# EAGLE design EEZ Mosfet pre-regulator r3B3b (SS) (EAGLE 6.1)
Assembly variants: Farnell, TME
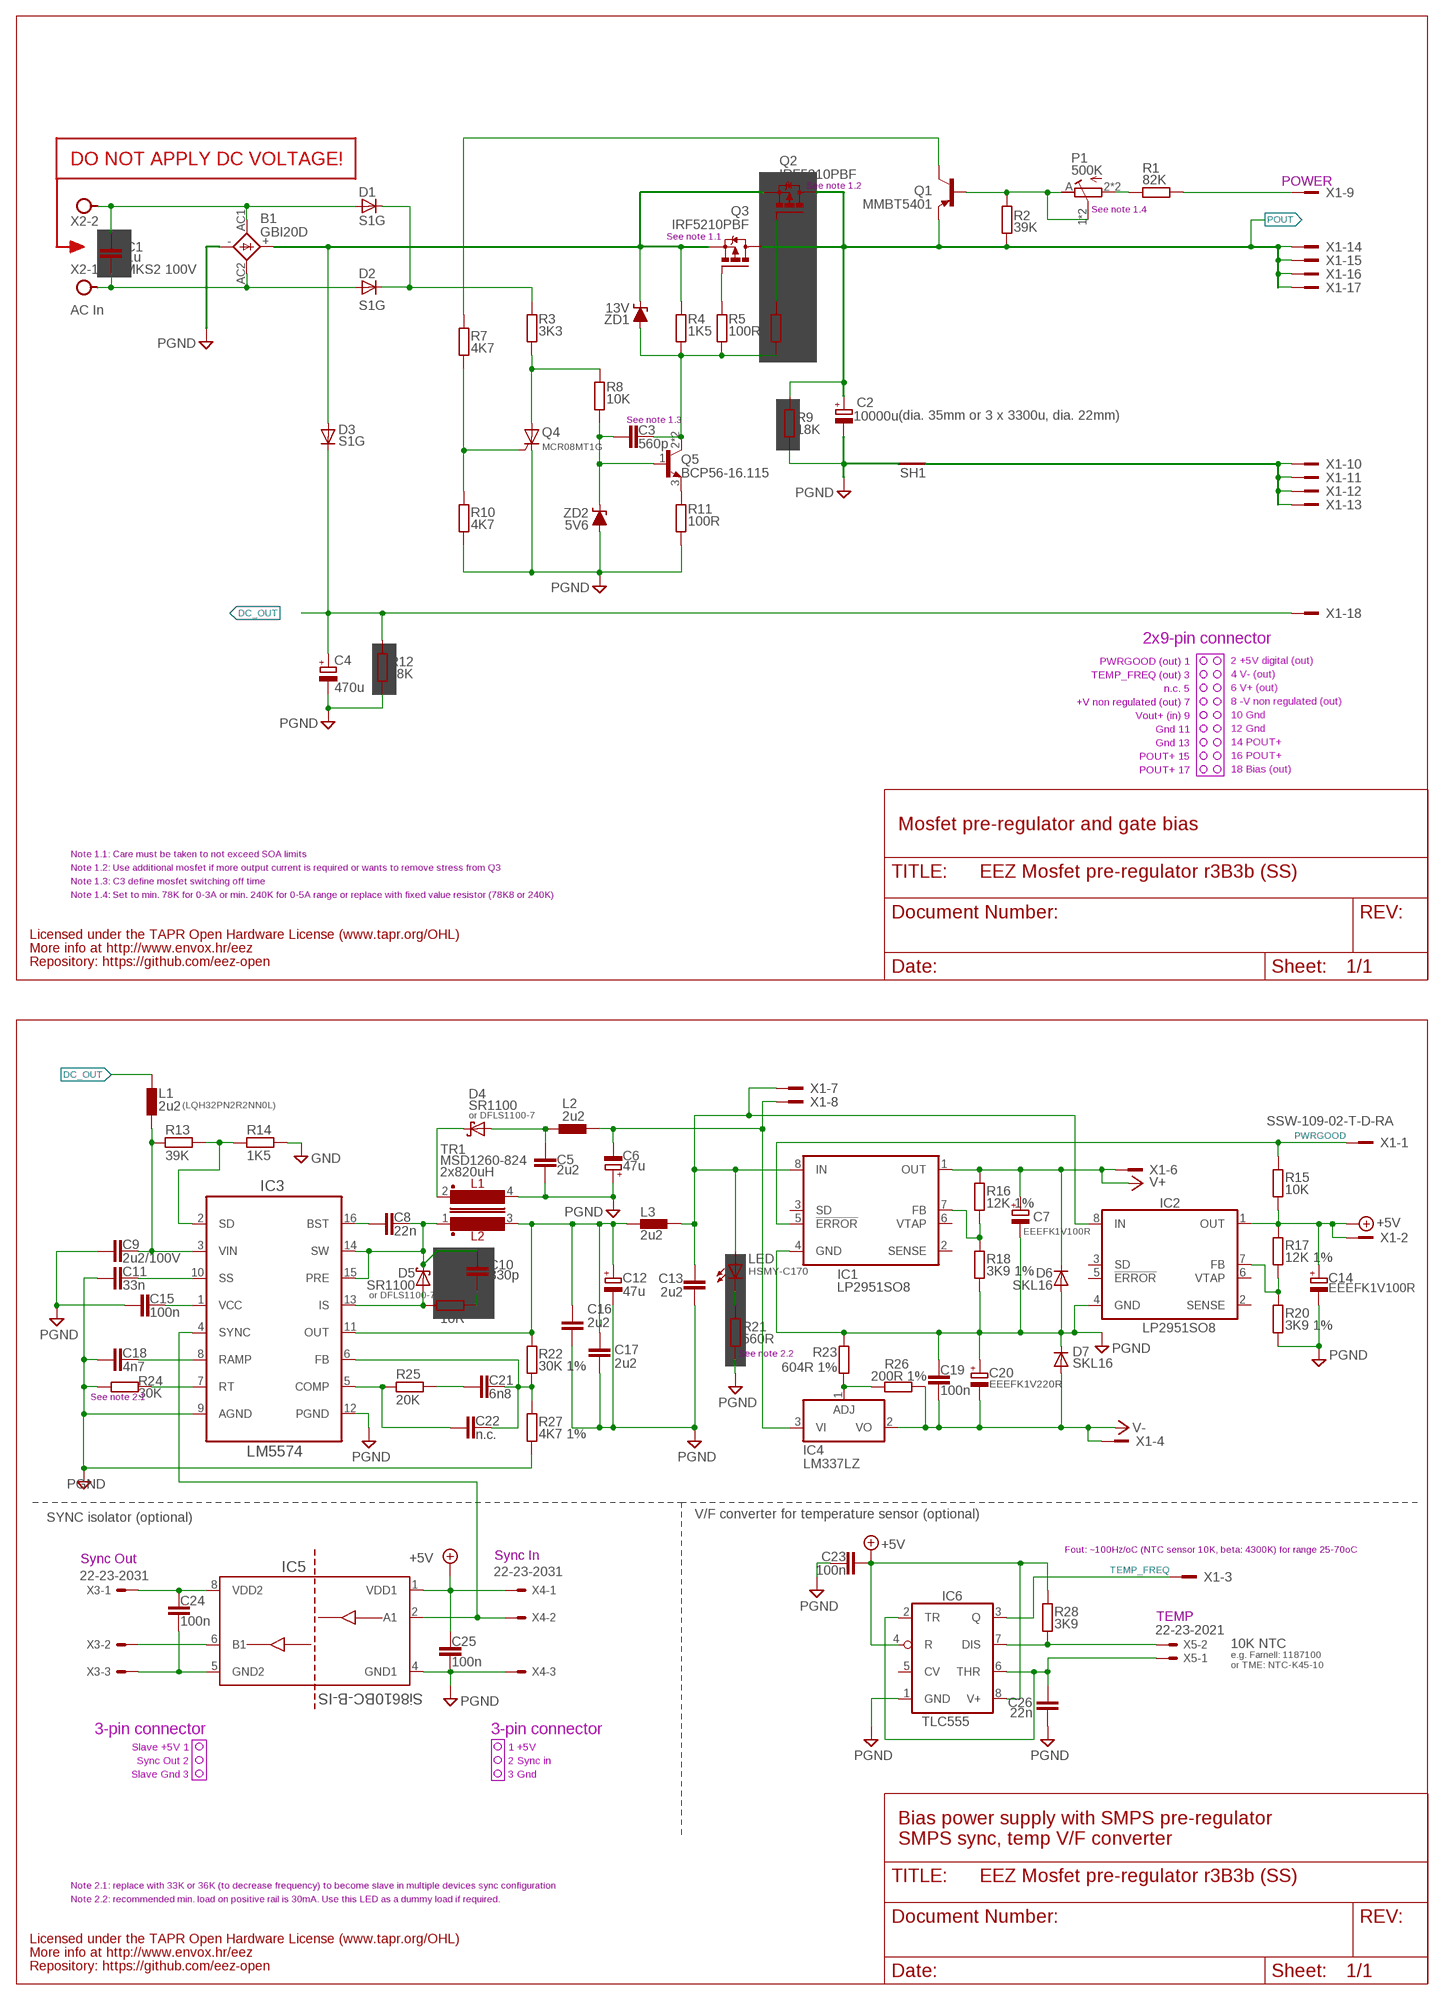
[diagram p0: schematic, sheet 1]

## Parts
B1  GBI20D  BRIDGEDIOTEC  [GBI20]
C1  1u  C-EU050-075X075  [C050-075X075]
C2  10000u  ECAP35+3X22.5  [ED35D+3XED22.5_COMBO]
C3  560p  C-EUC0805  [C0805]
C4  470u  ECAP5G_13MM  [ECAP5/13]
C5  2u2  C-EUC1210  [C1210]
C6  47u  ECAPEEEFK+8.5MM  [CAPAE660X610N_COMBO]
C7  EEEFK1V100R  ECAPEEEFK+5MM  [CAPAE430X610N_COMBO]
C8  22n  C-EUC0805  [C0805]
C9  2u2/100V  C-EUC1210  [C1210]
C10  330p  C-EUC0805  [C0805]
C11  33n  C-EUC0805  [C0805]
C12  47u  ECAPEEEFK+8.5MM  [CAPAE660X610N_COMBO]
C13  2u2  C-EUC1210  [C1210]
C14  EEEFK1V100R  ECAPEEEFK+5MM  [CAPAE430X610N_COMBO]
C15  100n  C-EUC0805  [C0805]
C16  2u2  C-EUC1210  [C1210]
C17  2u2  C-EUC1210  [C1210]
C18  4n7  C-EUC0805  [C0805]
C19  100n  C-EUC0805  [C0805]
C20  EEEFK1V220R  ECAPEEEFK+5MM  [CAPAE430X610N_COMBO]
C21  6n8  C-EUC0805  [C0805]
C22  n.c.  C-EUC0805  [C0805]
C23  100n  C-EUC0603  [C0603]
C24  100n  C-EUC0603  [C0603]
C25  100n  C-EUC0603  [C0603]
C26  22n  C-EUC0805  [C0805]
D1  S1G  DIODE-DO214AC  [DO214AC]
D2  S1G  DIODE-DO214AC  [DO214AC]
D3  S1G  DIODE-DO214AC  [DO214AC]
D4  SR1100  SCHOTTKYDO34+SOD123  [DO34+SOD123]
D5  SR1100  SCHOTTKYDO34+SOD123  [DO34+SOD123]
D6  SKL16  DIODE-DO214AC  [DO214AC]
D7  SKL16  DIODE-DO214AC  [DO214AC]
IC1  LP2951SO8  [SOIC127P600X175-8N]
IC2  LP2951SO8  [SOIC127P600X175-8N]
IC3  LM5574  [SOP65P640X110-16N]
IC4  LM337LZ  [TO92]
IC5  Si8610BC-B-IS  SI8610  [SOIC127P600X173-8N]
IC6  TLC555  LM555SOIC8  [SOIC127P600X175-8N]
L1  2u2  L1210COMBO  [L1210_COMBO]
L2  2u2  L1210COMBO  [L1210_COMBO]
L3  2u2  L1210COMBO  [L1210_COMBO]
LED  HSMY-C170  LEDCHIPLED_0805  [CHIPLED_0805]
P1  500K  R_TRIM_MIX0805  [R_TRIM+R0805]
Q1  MMBT5401  BC856B-PNP-SOT23-BEC  [SOT23-BEC]
Q2  IRF5210PBF  IRF9640  [TO220B-VMOS]
Q3  IRF5210PBF  IRF9640  [TO220B-VMOS]
Q4  MCR08MT1G  [SOT230P700X180-4N]
Q5  BCP56-16.115  BCP56  [SOT230P700X180-4N]
R1  82K  R-EU_R0805  [R0805]
R2  39K  R-EU_R0805  [R0805]
R3  3K3  R-EU_R0805  [R0805]
R4  1K5  R-EU_R0805  [R0805]
R5  100R  R-EU_R0805  [R0805]
R6  100R  R-EU_R0805  [R0805]
R7  4K7  R-EU_R0805  [R0805]
R8  10K  R-EU_R0805  [R0805]
R9  18K  R-EU_R0805  [R0805]
R10  4K7  R-EU_R0805  [R0805]
R11  100R  R-EU_R0805  [R0805]
R12  18K  R-EU_R0805  [R0805]
R13  39K  R-EU_R0805  [R0805]
R14  1K5  R-EU_R0805  [R0805]
R15  10K  R-EU_R0805  [R0805]
R16  12K 1%  R-EU_R0805  [R0805]
R17  12K 1%  R-EU_R0805  [R0805]
R18  3K9 1%  R-EU_R0805  [R0805]
R19  10R  R-EU_R1210  [R1210]
R20  3K9 1%  R-EU_R0805  [R0805]
R21  560R  R-EU_R0805  [R0805]
R22  30K 1%  R-EU_R0805  [R0805]
R23  604R 1%  R-EU_R0805  [R0805]
R24  30K  R-EU_R0805  [R0805]
R25  20K  R-EU_R0805  [R0805]
R26  200R 1%  R-EU_R0805  [R0805]
R27  4K7 1%  R-EU_R0805  [R0805]
R28  3K9  R-EU_R0805  [R0805]
SH1  SHORTH  [SHORT_2]
TR1  MSD1260-824  COILCRAFT_MSD1260INV  [MSD1260]
X1  SSW-109-02-T-D-RA  [SSW-109-02-T-D-RA]
X2  AC In  TBLOCK5.0_2A  [TBLOCK5.0_2]
X3  22-23-2031  [22-23-2031]
X4  22-23-2031  [22-23-2031]
X5  22-23-2021  [22-23-2021]
ZD1  13V  ZENER-DIODEMINIMELF  [MINIMELF]
ZD2  5V6  ZENER-DIODEMINIMELF  [MINIMELF]

## Nets
+5V: C14.1(+) C14.1.1(+) C23.1 C25.1 IC2.1(OUT) IC5.1(VDD1) IC6.4(R) IC6.8(V+) R15.2 R17.1 R28.2 X1.2 X4.1
+VNR: C13.1 IC1.8(IN) IC2.8(IN) L3.2 L3.2.1 LED.A X1.7
-VNR: C6.2(-) C6.2.1(-) IC4.3(VI) L2.2 L2.2.1 X1.8
DC_IN: B1.+ D3.A Q2.S Q3.S R4.1 ZD1.C
DC_OUT: C4.+ D3.C L1.1 L1.1.1 R12.1 X1.18
DC_PREG1: C9.1 IC3.3(VIN) L1.2 L1.2.1 R13.2
GND: B1.- C2.- C2.-1(-) C2.-2(-) C2.-3(-) C4.- C5.2 C6.1(+) C6.1.1(+) C7.2(-) C7.2.1(-) C9.2 C11.2 C12.2(-) C12.2.1(-) C13.2 C14.2(-) C14.2.1(-) C15.1 C16.2 C17.2 C18.1 C19.1 C20.1(+) C20.1.1(+) C23.2 C25.2 C26.1 D6.A D7.C IC1.4(GND) IC2.4(GND) IC3.9(AGND) IC3.12(PGND) IC5.4(GND1) IC6.1(GND) Q4.1(C) R9.2 R10.2 R11.2 R12.2 R14.1 R18.2 R20.2 R21.2 R23.2 R24.2 R27.2 SH1.2(GND_B) TR1.4 X4.3 ZD2.A ; supply symbol labelled PGND
IS: D5.A D5.A.1(A) IC3.13(IS) R19.1
N$2: Q5.3(E) R11.1
N$3: D1.C D2.C R3.1
N$4: Q3.G R5.1
N$5: P1.2(E) P1.E R1.1
N$6: Q4.3(G) R7.2 R10.1
N$8: C3.2 Q5.1(B) R8.2 ZD2.C
N$10: Q2.G R6.1
N$13: Q1.C R7.1
N$15: LED.C R21.1
N$17: SH1.1(GND_A) X1.10 X1.11 X1.12 X1.13
N$18: B1.AC1 C1.1 D1.A X2.2
N$19: IC1.7(FB) R16.2 R18.1
N$21: C10.2 R19.2
N$34: B1.AC2 C1.2 D2.A X2.1
N$64: IC2.7(FB) R17.2 R20.1
N$77: C21.2 R25.2
N$79: P1.1(S) P1.A P1.S Q1.B R2.1
N$127: IC5.6(B1) X3.2
N$128: C21.1 C22.1 IC3.6(FB) R22.2 R27.1
N$131: C8.2 IC3.16(BST)
N$135: C22.2 IC3.5(COMP) R25.1
N$165: IC3.7(RT) R24.1
N$166: C15.2 IC3.1(VCC)
N$167: C18.2 IC3.8(RAMP)
N$168: C11.1 IC3.10(SS)
N$179: C5.1 D4.A D4.A.1(A) L2.1 L2.1.1
N$180: IC3.2(SD) R13.1 R14.2
N$187: R1.2 X1.9
N$188: IC6.7(DIS) R28.1 X5.2
N$190: C26.2 IC6.2(TR) IC6.6(THR) X5.1
N$193: C24.1 IC5.8(VDD2) X3.1
N$198: C24.2 IC5.5(GND2) X3.3
N$202: IC4.1(ADJ) R23.1 R26.2
POUT [isolators]: C2.+ C2.+2(+) C2.+3(+) Q1.E Q2.D Q3.D R2.2 R9.1 X1.14 X1.15 X1.16 X1.17
PWRGOOD: IC1.5(!ERROR) R15.1 X1.1
Q4A: Q4.2(A) Q4.4(A) R3.2 R8.1
Q5C: C3.1 Q5.2(C) Q5.4(C) R4.2 R5.2 R6.2 ZD1.A
SW: C8.1 C10.1 D5.C D5.C.1(C) IC3.14(SW) IC3.15(PRE) TR1.1
SYNC: IC3.4(SYNC) IC5.2(A1) X4.2
TEMP_FREQ: IC6.3(Q) X1.3
V+: C7.1(+) C7.1.1(+) D6.C IC1.1(OUT) R16.1 X1.6
V-: C19.2 C20.2(-) C20.2.1(-) D7.A IC4.2(VO) R26.1 X1.4
VOUT+: C12.1(+) C12.1.1(+) C16.1 C17.1 IC3.11(OUT) L3.1 L3.1.1 R22.1 TR1.3
VOUT-: D4.C D4.C.1(C) TR1.2
Unconnected: IC1.2(SENSE) IC1.3(SD) IC1.6(VTAP) IC2.2(SENSE) IC2.3(SD) IC2.5(!ERROR) IC2.6(VTAP) IC6.5(CV) X1.5

## Notes on the sheet
- DO NOT APPLY DC VOLTAGE!
- POWER
- See note 1.2
- See note 1.4
- See note 1.1 | Set to 88K
- MKS2 100V
- (dia. 35mm or 3 x 3300u, dia. 22mm)
- See note 1.3
- 2x9-pin connector
- PWRGOOD (out) 1
- 2 +5V digital (out)
- TEMP_FREQ (out) 3
- 4 V- (out)
- n.c. 5
- 6 V+ (out)
- +V non regulated (out) 7
- 8 -V non regulated (out)
- Vout+ (in) 9
- 10 Gnd
- Gnd 11
- 12 Gnd
- Gnd 13
- 14 POUT+
- POUT+ 15
- 16 POUT+
- POUT+ 17
- 18 Bias (out)
- Mosfet pre-regulator and gate bias
- Note 1.1: Care must be taken to not exceed SOA limits
- Note 1.2: Use additional mosfet if more output current is required or wants to remove stress from Q3
- Note 1.3: C3 define mosfet switching off time
- Note 1.4: Set to min. 78K for 0-3A or min. 240K for 0-5A range or replace with fixed value resistor (78K8 or 240K)
- Licensed under the TAPR Open Hardware License (www.tapr.org/OHL)
- More info at http://www.envox.hr/eez
- Repository: https://github.com/eez-open
- (LQH32PN2R2NN0L)
- or DFLS1100-7
- 2x820uH
- or DFLS1100-7
- See note 2.2
- See note 2.1
- SYNC isolator (optional) | V/F converter for temperature sensor (optional)
- Fout: ~100Hz/oC (NTC sensor 10K, beta: 4300K) for range 25-70oC
- Sync Out | Sync In
- TEMP
- 10K NTC
- e.g. Farnell: 1187100
- or TME: NTC-K45-10
- 3-pin connector | 3-pin connector
- Slave +5V 1 | 1 +5V
- Sync Out 2 | 2 Sync in
- Slave Gnd 3 | 3 Gnd
- Bias power supply with SMPS pre-regulator
- SMPS sync, temp V/F converter
- Note 2.1: replace with 33K or 36K (to decrease frequency) to become slave in multiple devices sync configuration
- Note 2.2: recommended min. load on positive rail is 30mA. Use this LED as a dummy load if required.
- Licensed under the TAPR Open Hardware License (www.tapr.org/OHL)
- More info at http://www.envox.hr/eez
- Repository: https://github.com/eez-open

## Library data of the parts
B1 = EEZ_Lib1:BRIDGE: MULTICOMP - KBP202G - BRIDGE RECTIFIER, 200V, 2A, KBP Farnell: 1861413
C1 C3 C5 C8-C11 C13 C15-C19 C21-C26 = rcl:C-EU: CAPACITOR, European symbol
C2 C4 C6 C7 C12 C14 C20 = EEZ_Lib1:ECAP
D1-D3 D6 D7 = diode:DIODE-: DIODE
D4 D5 = EEZ_Lib1:SCHOTTKY
IC1 IC2 = EEZ_Lib1:LP2951: LP2950-N/LP2951-N Series of Adjustable Micropower Voltage Regulators
IC3 = EEZ_Lib1:LM5574: Step-Down Switching Regulator; MPN: LM5574MT; OC_FARNELL: 1325419; OC_NEWARK: 32M1267; PACKAGE: TSSOP-16; SUPPLIER: National Semiconductors
IC4 = linear:*337: Negative VOLTAGE REGULATOR
IC5 = EEZ_Lib1:SI8610: Low power 1-ch digital isolator Farnell: 2423233, 2423234
IC6 = EEZ_Lib1:LM555
L1-L3 = EEZ_Lib1:L1210
LED = led:LED: LED OSRAM: - CHIPLED LG R971, LG N971, LY N971, LG Q971, LY Q971, LO R971, LY R971 LH N974, LH R974 LS Q976, LO Q976, LY Q976 LO Q996 - Hyper CHIPLED LW Q18S LB Q993, LB Q99A, LB R99A - SideLED LS A670, LO A670, LY A670, LG A670, LP A670 LB A673, LV A673, LT A673, LW A673 LH A674 LY A675 LS A676, LA A676, LO A676, LY A676, LW A676 LS A679, LY A679, LG A679 - Hyper Micro SIDELED® LS Y876, LA Y876, LO Y876, LY Y876 LT Y87S - SmartLED LW L88C, LW L88S LB L89C, LB L89S, LG L890 LS L89K, LO L89K, LY L89K LS L896, LA L896, LO L896, LY L896 - TOPLED LS T670, LO T670, LY T670, LG T670, LP T670 LSG T670, LSP T670, LSY T670, LOP T670, LYG T670 LG T671, LOG T671, LSG T671 LB T673, LV T673, LT T673, LW T673 LH T674 LS T676, LA T676, LO T676, LY T676, LB T676, LH T676, LSB T676, LW T676 LB T67C, LV T67C, LT T67C, LS T67K, LO T67K, LY T67K, LW E67C LS E67B, LA E67B, LO E67B, LY E67B, LB E67C, LV E67C, LT E67C LW T67C LS T679, LY T679, LG T679 LS T770, LO T770, LY T770, LG T770, LP T770 LB T773, LV T773, LT T773, LW T773 LH T774 LS E675, LA E675, LY E675, LS T675 LS T776, LA T776, LO T776, LY T776, LB T776 LHGB T686 LT T68C, LB T68C - Hyper Mini TOPLED® LB M676 - Mini TOPLED Santana® LG M470 LS M47K, LO M47K, LY M47K Source: http://www.osram.convergy.de LUXEON: - LUMILED® LXK2-PW12-R00, LXK2-PW12-S00, LXK2-PW14-U00, LXK2-PW14-V00 LXK2-PM12-R00, LXK2-PM12-S00, LXK2-PM14-U00 LXK2-PE12-Q00, LXK2-PE12-R00, LXK2-PE12-S00, LXK2-PE14-T00, LXK2-PE14-U00 LXK2-PB12-K00, LXK2-PB12-L00, LXK2-PB12-M00, LXK2-PB14-N00, LXK2-PB14-P00, LXK2-PB14-Q00 LXK2-PR12-L00, LXK2-PR12-M00, LXK2-PR14-Q00, LXK2-PR14-R00 LXK2-PD12-Q00, LXK2-PD12-R00, LXK2-PD12-S00 LXK2-PH12-R00, LXK2-PH12-S00 LXK2-PL12-P00, LXK2-PL12-Q00, LXK2-PL12-R00 Source: www.luxeon.com KINGBRIGHT: KA-3528ASYC Source: www.kingbright.com
P1 = EEZ_Lib1:R_TRIM_MIX
Q1 = transistor:*-PNP-: PNP Transistror
Q2 Q3 = EEZ_Lib1:IRF9640: P-ch MOSFET, 11 A, 200 V, 500 mohm, -10 V, -4 V; FARNELL: 8648654; TME: IRF9640PBF
Q4 = EEZ_Lib1:MCR08MT1G: THYRISTOR, 0.6A, 800V, SOT-223; FARNELL: 1459080; TME: MCR08MT1G
Q5 = EEZ_Lib1:BCP56: Low power NPN Transistor, Vceo=80V, Ic=1A, SOT-223
R1-R28 = rcl:R-EU_: RESISTOR, European symbol
SH1 = EEZ_Lib1:SHORT
TR1 = EEZ_Lib1:COILCRAFT_MSD1260INV: Coilcraft Coupled Inductors MSD1260 (inverted pinouts)
X1 = EEZ_Lib1:SSW-109-02-T-D-RA: Samtec SSW-109-02-T-D-RA Receptacle, 2.54MM, RA, 18-way; FARNELL: 1804359
X2 = EEZ_Lib1:TBLOCK5.0_2A
X3 X4 = con-molex:22-23-2031: .100" (2.54mm) Center Header - 3 Pin; MF: MOLEX; MPN: 22-23-2031; OC_FARNELL: 1462950; OC_NEWARK: 30C0862
X5 = con-molex:22-23-2021: .100" (2.54mm) Center Header - 2 Pin; MF: MOLEX; MPN: 22-23-2021; OC_FARNELL: 1462926; OC_NEWARK: 25C3832
ZD1 ZD2 = EEZ_Lib1:ZENER-DIODE

## Net classes
0 default: width 0.254 mm, drill 0.61 mm, clearance 0.254 mm
2 gnd: width 0.254 mm, drill 0.61 mm, clearance 0.254 mm
3 isolators: width 0.254 mm, drill 0.61 mm, clearance 0.254 mm
4 aref: width 0.254 mm, drill 0.61 mm, clearance 0.254 mm

## Board
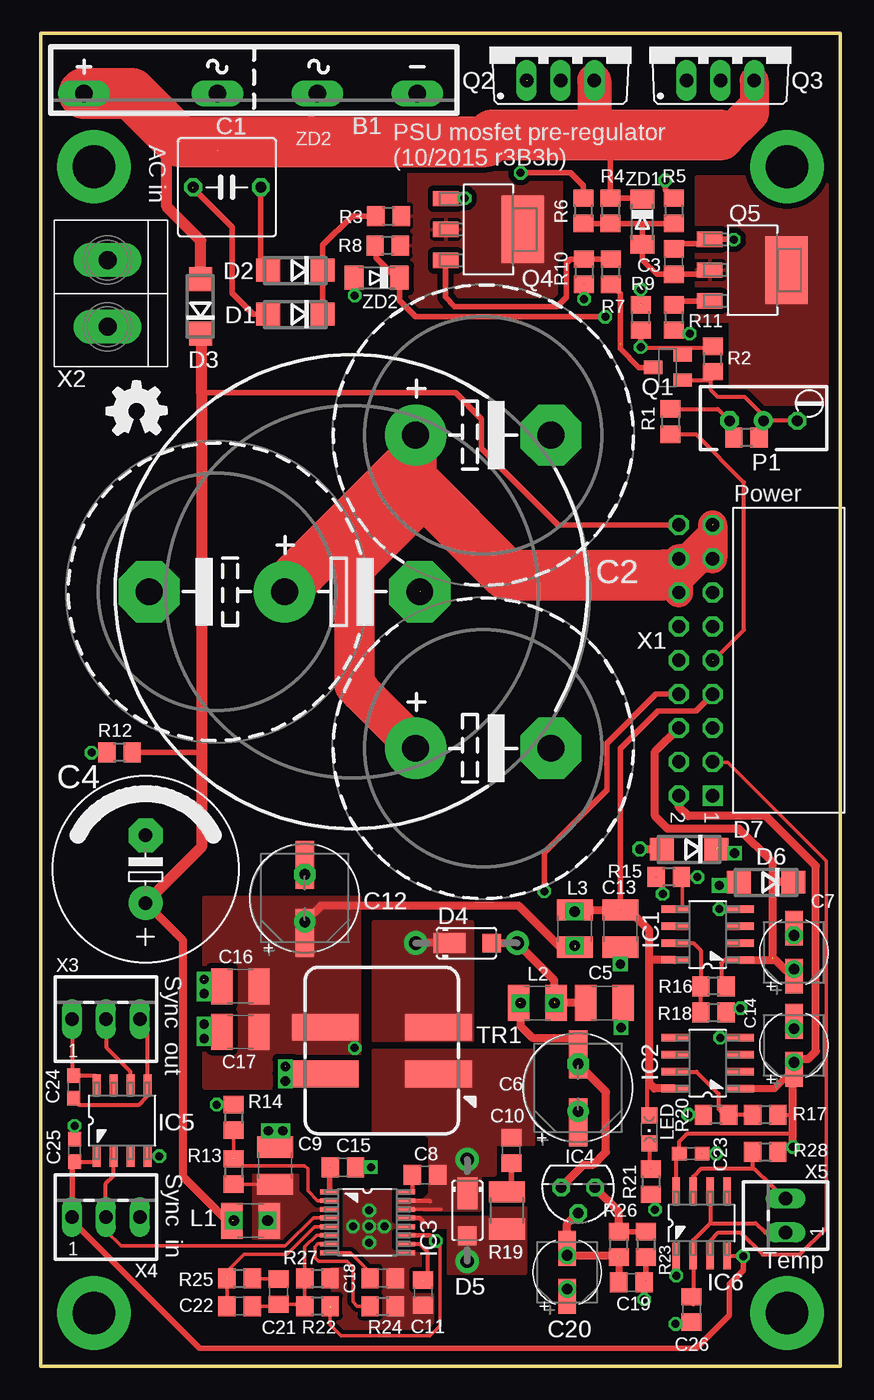
[diagram p1: board, top side]
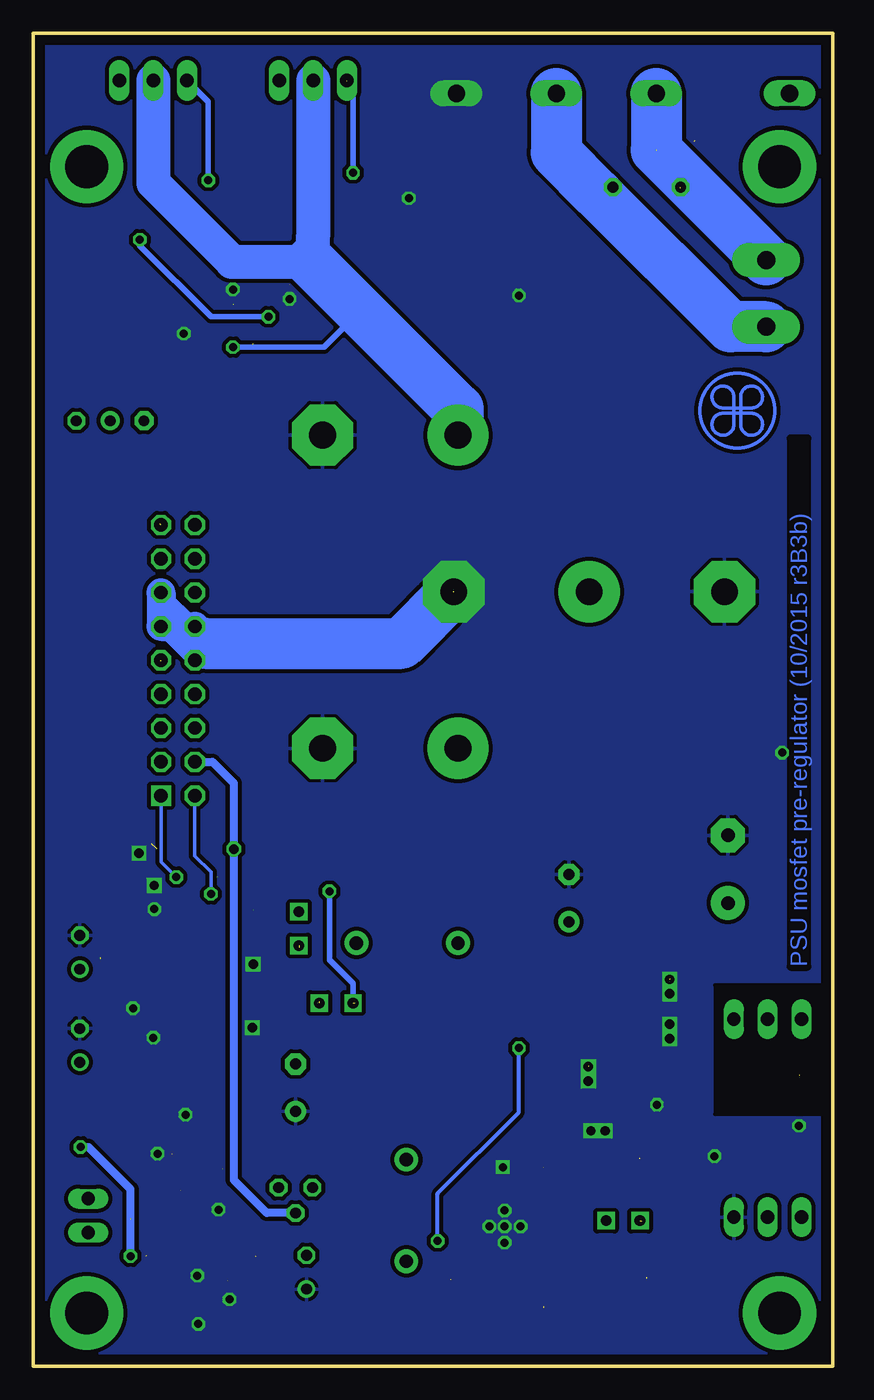
[diagram p2: board, bottom side, seen from below]

Size 60 x 100 mm. Coordinates in mm from the lower left corner, seen from the top.
Outline: 0,100 60,100 60,0 0,0 0,100
Copper layers (1+5*16): Top 0.035mm / dielectric 0.75mm / Route5 0.035mm / dielectric 0.75mm / Bottom 0.035mm
Design rules: minimum track width 10mil, minimum drill 0.5mm, track to track 8mil, track to pad 8mil, pad to pad 8mil, via to via 8mil, smd to smd 8mil, copper to edge 30mil, drill to drill 8mil, minimum pad ring 10mil, minimum via ring 8mil, stop-mask expansion 0mil, vias tented up to drill 25mil, thermal gap 10mil

### Footprints (pad centres in the part's own frame; a part is rotated, then mirrored left to right if it is on the bottom)
GBI20 = drill 1.3 long: + -12.75,-3.5; - 12.25,-3.5; AC1 -2.75,-3.5; AC2 4.75,-3.5
C050-075X075 = drill 0.813 octagon: 1 -2.54,0; 2 2.54,0
ED35D+3XED22.5_COMBO = drill 2.007 pad 4.597: + -5.08,0; +2 4.763,11.748; +3 4.763,-11.748 | drill 2.007 pad 4.597 octagon: - 5.08,0; -1 -15.24,0; -2 14.922,11.748; -3 14.922,-11.748
C0805 = smd 1.3 x 1.5: 1 -0.95,0; 2 0.95,0
ECAP5/13 = drill 1.016 pad 2.54: + -2.54,0 | drill 1.016 pad 2.54 octagon: - 2.54,0
C1210 = smd 1.6 x 2.7: 1 -1.4,0; 2 1.4,0
CAPAE660X610N_COMBO = smd 3.6 x 1.4: 1 -2.6,0; 2 2.5,0 | drill 0.813 pad 1.6: 1.1 -1.778,0 | drill 0.813 pad 1.6 octagon: 2.1 1.778,0
CAPAE430X610N_COMBO = smd 2.6 x 1.3: 1 -1.8,0; 2 1.8,0 | drill 0.8: 1.1 -1.27,0 | drill 0.8 octagon: 2.1 1.27,0
C0603 = smd 1.1 x 1: 1 -0.85,0; 2 0.85,0
DO214AC = smd 1.8 x 1.7: A 2.05,0; C -2.05,0
DO34+SOD123 = drill 1 pad 1.778: A 3.81,0; C -3.81,0 | smd 1.4 x 1.4: A.1 1.9,0 | smd 2.4 x 1.5: C.1 -1.27,0
SOIC127P600X175-8N = smd 1.981 x 0.559: 1 -2.464,1.905; 2 -2.464,0.635; 3 -2.464,-0.635; 4 -2.464,-1.905; 5 2.464,-1.905; 6 2.464,-0.635; 7 2.464,0.635; 8 2.464,1.905
SOP65P640X110-16N = smd 1.422 x 0.356: 1 -2.845,2.286; 2 -2.845,1.626; 3 -2.845,0.965; 4 -2.845,0.33; 5 -2.845,-0.33; 6 -2.845,-0.965; 7 -2.845,-1.626; 8 -2.845,-2.286; 9 2.845,-2.286; 10 2.845,-1.626; 11 2.845,-0.965; 12 2.845,-0.33; 13 2.845,0.33; 14 2.845,0.965; 15 2.845,1.626; 16 2.845,2.286
TO92 = drill 0.813 octagon: 1 -1.27,0; 2 0,1.905; 3 1.27,0
SOIC127P600X173-8N = smd 1.55 x 0.6: 1 -2.7,1.9; 2 -2.7,0.63; 3 -2.7,-0.64; 4 -2.7,-1.91; 5 2.7,-1.91; 6 2.7,-0.64; 7 2.7,0.63; 8 2.7,1.9
L1210_COMBO = smd 1.6 x 2.7: 1 -1.4,0; 2 1.4,0 | drill 0.8 square: 1.1 -1.27,0; 2.1 1.27,0
CHIPLED_0805 = smd 1.2 x 1.2: A 0,-1.05; C 0,1.05
R_TRIM+R0805 = smd 1.3 x 1.5: 1 0.32,1.27; 2 2.22,1.27 | drill 0.813 octagon: A -2.54,0 | drill 0.8 pad 1.422 octagon: E 2.54,0 | drill 0.8 pad 1.422: S 0,0
SOT23-BEC = smd 1 x 1.4: B -0.95,-1.1; C 0,1.1; E 0.95,-1.1
TO220B-VMOS = drill 1.016 long: D 0,-2.54; G -2.54,-2.54; S 2.54,-2.54
SOT230P700X180-4N = smd 1.905 x 1.143: 1 -3.2,2.311; 2 -3.2,0; 3 -3.2,-2.311 | smd 3.175 x 5.08: 4 2.565,0
R0805 = smd 1.3 x 1.5: 1 -0.95,0; 2 0.95,0
R1210 = smd 1.6 x 2.7: 1 -1.4,0; 2 1.4,0
SHORT_2 = drill 1.1 octagon: 1 0,0 | drill 1.1 pad 1.778 octagon: 2 0,0
MSD1260 = smd 2 x 5: 1 1.75,4.25; 2 -1.75,4.25; 3 -1.75,-4.25; 4 1.75,-4.25
SSW-109-02-T-D-RA = drill 1 pad 1.5 square: 1 20.32,2.54 | drill 1 pad 1.5 octagon: 2 20.32,0; 3 17.78,2.54; 4 17.78,0; 5 15.24,2.54; 6 15.24,0; 7 12.7,2.54; 8 12.7,0; 9 10.16,2.54; 10 10.16,0; 11 7.62,2.54; 12 7.62,0; 13 5.08,2.54; 14 5.08,0; 15 2.54,2.54; 16 2.54,0; 17 0,2.54; 18 0,0
TBLOCK5.0_2 = drill 1.35 pad 2.54 long: 1 0,0; 2 0,-5
22-23-2031 = drill 1 long: 1 -2.54,0; 2 0,0; 3 2.54,0
22-23-2021 = drill 1 long: 1 -1.27,0; 2 1.27,0
MINIMELF = smd 1.4 x 1.8: A 1.7,0; C -1.7,0

### Placement (x,y rotation side)
B1  16,99 0 top
C1  13.97,88.46 0 top
C2  23.37,58.1 0 top
C3  47.5,82.87 90 top
C4  7.87,37.29 90 top
C5  42.29,27.24 0 top
C6  40.32,20.89 90 top
C7  56.52,31.05 90 top
C8  28.83,14.35 180 top
C9  17.59,15.05 90 top
C10  35.31,16.19 270 top
C11  28.7,5.52 270 top
C12  19.81,35.12 90 top
C13  43.5,32.83 270 top
C14  56.52,24.07 90 top
C15  22.67,14.92 180 top
C16  14.99,28.51 180 top
C17  14.99,25.08 180 top
C18  25.65,6.6 180 top
C19  44.32,6.29 180 top
C20  39.5,7.05 90 top
C21  17.84,5.59 90 top
C22  14.92,4.51 180 top
C23  48.77,15.94 0 top
C24  2.48,20.95 270 top
C25  2.54,16.19 90 top
C26  48.83,4.25 90 top
D1  19.11,78.93 180 top
D2  19.11,82.23 180 top
D3  12,79.5 90 top
D4  31.94,31.75 0 top
D5  32,11.68 270 top
D6  54.42,36.32 180 top
D7  48.64,38.8 180 top
EEZ_SIGNATURE  SIGNATURESMALL  [SIGNATURE_5MM]  7.17,71.69 180 top
IC1  50.04,32.38 180 top
IC2  50.04,22.73 180 top
IC3  24.51,10.79 0 top
IC4  40.32,13.4 180 top
IC5  6.1,18.41 90 top
IC6  49.59,10.73 90 top
L1  15.75,10.92 0 top
L2  37.27,27.24 180 top
L3  40.07,32.83 90 top
LED  45.66,17.78 180 top
P1  54.23,70.93 180 top
Q1  47.05,74.93 90 top
Q2  39,99 0 top
Q3  51,99 0 top
Q4  33.59,85.28 0 top
Q5  53.4,82.23 0 top
R1  47.24,70.87 270 top
R2  50.42,75.56 90 top
R3  26.1,86.3 0 top
R4  42.74,86.68 270 top
R5  47.5,86.68 270 top
R6  40.7,86.68 270 top
R7  42.8,82.11 90 top
R8  26.04,84.07 180 top
R9  45.02,78.68 90 top
R10  40.77,82.11 270 top
R11  47.5,78.68 270 top
R12  5.91,46.04 180 top
R13  14.48,14.61 270 top
R14  14.48,18.67 270 top
R15  47.12,36.7 180 top
R16  50.48,28.51 180 top
R17  54.36,18.86 180 top
R18  50.48,26.54 0 top
R19  34.99,11.68 90 top
R20  50.67,18.86 180 top
R21  45.78,13.84 270 top
R22  20.76,4.51 180 top
R23  45.4,9.14 270 top
R24  25.65,4.51 0 top
R25  14.92,6.6 0 top
R26  43.37,9.14 90 top
R27  20.76,6.6 0 top
R28  54.36,16.07 0 top
SH1  28.51,58.1 0 top
TR1  25.59,23.69 270 top
X1  47.88,63.12 270 top
X2  5,77.99 180 top
X3  4.89,26.04 0 top
X4  4.89,11.18 0 top
X5  55.88,11.3 90 top
ZD1  45.15,85.85 270 top
ZD2  25.21,81.66 180 top

### Tracks (layer width: path | path; a pad name or v marks a point on that pad's centre or on a via)
+5V  (via drill 0.6)  (3 unrouted)
  Top 0.254: v46.67,35.43 46.67,36.2 R15.2 | R28.2 56.39,16.38 v56.45,16.45
  Top 0.305: X4.1 2.35,10.92 | 2.35,15.15 C25.1 4.2,15.34 IC5.1 | 55.31,21.02 55.26,21.02 55.22,20.98 | R17.1 56.45,18.86 | v52.7,8.26 51.56,8.26 | IC6.8 47.69,15.71 C23.1 47.92,16.87 48.51,17.46 56.39,17.46 56.45,17.4 v56.45,16.45
  Top 0.406: 2.35,10.92 11.94,1.33 49.21,1.33 51.69,3.81 51.69,6.16 52.7,7.18 v52.7,8.26 | X4.1 2.35,15.15
  Top 0.508: 56.52,23.05 C14.1.1 56.52,22.73 C14.1 55.22,20.98 55.08,20.83 IC2.1
  Top 0.61: 56.52,23.05 57.59,23.05 58.17,23.62 58.17,37.53 54.42,41.27 48.58,41.27 47.88,41.97 X1.2 | v56.45,16.45 56.45,18.86 56.45,22.67 56.52,22.73
  Bottom 0.254: X1.2 47.88,38.29 46.67,37.08 v46.67,35.43
  Bottom 0.305: 52.64,11.11 52.7,11.18
  Bottom 0.61: 52.7,11.18 52.7,13.27 55.88,16.45 v56.45,16.45 | v52.7,8.26 52.7,11.05
+VNR  (1 unrouted)
  Top 0.305: LED.A 45.94,18.83 45.53,19.24 45.53,21.21 | 45.53,21.21 45.53,21.34 45.59,21.4 | 45.66,21.21 45.53,21.21
  Top 0.406: IC2.8 | C13.1 43.5,46.35 46.29,49.15 49.15,49.15 X1.7
  Top 0.61: L3.2.1 L3.2 C13.1 | IC2.8 46.04,20.83 45.66,21.21 45.66,30.54 | 43.43,34.23 43.43,34.29 C13.1 44.13,34.23 45.66,32.7 45.66,30.54 | IC1.8 45.72,30.48 45.66,30.54
-VNR  (via drill 0.6)  (1 unrouted)
  Top 0.406: v37.78,35.62 37.78,38.54 42.48,43.24 42.48,46.74 46.16,50.42 X1.8
  Top 0.61: IC4.3 39.05,13.46 40.7,15.11 41.47,15.11 42.42,16.07 42.42,20.57 C6.2.1 40.26,22.73 40.26,24.64 36.89,24.64 36.01,25.53 L2.2.1
  Top 0.813: C6.2 C6.2.1
  Bottom 0.406: L2.2.1 36.01,28.7 37.78,30.48 v37.78,35.62
DC_IN  (1 unrouted)
  Top 0.406: 43.18,91.82 43.75,92.39 | 42.67,92.39 42.74,92.33 R4.1 45.07,87.63 ZD1.C
  Top 0.813: D3.A 12,84.45 9.46,87 9.46,91.06 10.35,91.95
  Top 2.184: Q3.S 53.54,94.68 | 53.54,94.68 53.54,93.86 51.31,91.63 | 50.93,92.39 50.75,91.89 53.54,94.68
  Top 2.54: Q2.S 41.54,92.15 41.66,92.39
  Top 3.81: 10.41,91.89 20.32,91.89 33.4,91.89 33.91,92.39 41.66,92.39 42.67,92.39 43.75,92.39 50.93,92.39 | B1.+ 6.8,95.5 10.35,91.95
DC_OUT  (1 unrouted)
  Top 0.406: 12.06,73.03 31.11,73.03 33.08,71.06 33.08,68.83 36.2,65.72 36.26,65.66 38.8,63.12 X1.18 | R12.1 12,46.04 12.06,46.1
  Top 0.61: L1.1.1 13.97,10.92 10.67,14.22 10.67,31.95 C4.+
  Top 0.813: C4.+ 12.06,38.95 12.06,46.1 12.06,73.03 12.06,77.39 D3.C
DC_PREG1
  Top 0.254: R13.2 C9.1
  pour Top (isolate 0.305, no thermals): 21.65,11.81 21.65,11.68 20.45,11.68 19.94,11.18 18.8,9.97 18.41,9.53 15.94,9.53 15.94,14.35 19.3,14.35 19.3,13.14 20.64,11.81
GND  (via drill 0.6, 0.7)  (9 unrouted)
  Top 0.254: v18.16,17.65 16.95,16.77 C9.2 | C5.2 43.69,25.53 v43.56,25.4 | v43.5,30.16 C13.2
  Top 0.305: C15.1 v24.77,14.92 | C25.2 v2.54,18.03 | v8.89,15.75 8.04,15.75 IC5.4 | v52.51,26.86 51.69,26.86 R18.2 | v47.69,6.79 IC6.1 | C12.2.1 C12.2 | C6.1.1 C6.1 40.26,18.29 | R20.2 v48.58,18.86 | C16.2 12.7,28.51 12.19,29.02 | C17.2 12.76,25.08 v12.26,24.57 | v50.67,15.94 49.59,15.94 | v46.1,11.75 46.1,12.57 R21.2
  Top 0.406: R14.1 v13.21,19.62 | v40.77,80.07 R10.2 | v31.81,87.63 30.43,87.63 Q4.1 | v48.7,77.47 47.76,77.47 R11.2 | v45.02,80.77 45.02,79.69 45.09,79.63 | v3.81,46.04 R12.2 | v23.56,80.33 23.56,81.61 ZD2.A | C20.1.1 C20.1 | 45.66,7.94 R23.2 45.4,6.42 C19.1 | v45.28,5.02 45.28,5.97 45.4,6.41 | 52.83,24.64 IC2.4 v50.99,24.64 | IC1.4 v50.93,34.29 | 47.69,8.95 IC6.1 | v47.62,3.17 48.7,3.17 C26.1 | v52.07,38.48 51.12,39.18
  Top 0.508: TR1.4 18.35,21.94 18.35,22.54 | C7.2.1 C7.2 | C14.2 C14.2.1
  Top 0.61: D6.A 52.26,36.7 52.26,36.2 v50.93,36.07
  other vias: 12.26,27.94 12.26,29.02 12.26,25.65 17.08,17.65 18.35,21.4 18.35,22.48 24.64,11.68 25.78,10.48 24.64,10.48 23.43,10.48 24.64,9.27
  pour Bottom (isolate 0.305, no thermals): 25.27,53.4 25.21,61.59 31.24,61.66 31.24,53.4
  pour Bottom (isolate 0.305): 0,0 60.01,0 60.01,100.01 0,100.01
  pour Top (isolate 0.305, no thermals): 22.23,13.14 26.86,13.14 26.86,8.45 29.97,8.45 29.97,2.86 21.91,2.86 21.91,7.87 22.23,7.87
HOLE_DL  (via drill 3.2 pad 5.5)
  other vias: 4,4
HOLE_DR  (via drill 3.2 pad 5.5)
  other vias: 56,4
HOLE_UL  (via drill 3.2 pad 5.5)
  other vias: 4,90
HOLE_UR  (via drill 3.2 pad 5.5)
  other vias: 56,90
IS
  Top 0.356: IC3.13 28.43,11.12 28.64,10.92
  pour Top (isolate 0.305, no thermals): 27.62,11.18 33.78,11.18 33.78,12.45 36.39,12.45 36.39,6.99 30.61,6.99 30.61,10.41 28.57,10.41 28.57,10.92 28.45,11.05 27.62,11.05
N$2
  Top 0.406: Q5.3 47.79,79.92 R11.1
N$3
  Top 0.406: D1.C D2.C 21.16,84.09 23.37,86.3 R3.1
N$4  (via drill 0.6)
  Top 0.406: v46.86,88.96 46.86,88.26 R5.1
  Bottom 0.406: v46.86,88.96 46.86,94.86 Q3.G
N$5
  Top 0.305: R1.1 50.8,71.82 P1.E 52.01,70.61 P1.2
N$6
  Top 0.406: R7.2 R10.1 39.75,83.06 39.43,82.74 39.43,80.2 38.73,79.5 31.05,79.5 30.35,80.2 30.35,82.93 Q4.3 30.48,83.06
N$8  (via drill 0.6)
  Top 0.406: v52.01,84.52 51.98,84.54 Q5.1 50.2,84.29 50.29,84.2 47.88,84.2 C3.2 | R8.2 25.15,84.01 25.15,83.19 26.67,81.66 ZD2.C 26.92,81.65 26.92,79.95 28.13,78.74 v42.35,78.74
  Bottom 0.406: v52.01,84.52 52.01,84.07 46.67,78.74 v42.35,78.74
N$10  (via drill 0.6)  (1 unrouted)
  Top 0.406: v36.01,89.53 39.75,89.53 40.7,88.58 R6.1
  Bottom 0.406: v36.01,89.53 36.01,95.95 36.51,96.46
N$13  (1 unrouted)
  Top 0.406: Q1.C 44.9,74.93 43.5,76.33 43.5,76.64 | 43.5,76.71 43.5,80.46 R7.1
N$15  (1 unrouted)
  Top 0.305: LED.C 45.66,14.92 R21.1
N$17
  Bottom 0.254: 50.35,57.78 50.35,57.98 X1.13 | X1.10 48.13,53.21 48.07,53.28 47.12,54.23
  Bottom 1.27: 50.29,55.5 48.07,53.28 | 50.35,57.78 48.13,55.56
  Bottom 2.184: X1.13 X1.11 50.29,55.5 X1.12
  Bottom 3.81: 47.12,54.23 32.38,54.23 SH1.1
N$18  (2 unrouted)
  Top 0.406: D1.A 15.94,78.93 14.35,80.52 14.35,85.47 11.43,88.39
  Bottom 0.406: C1.1 11.43,89.34 13.27,91.19
  Bottom 3.81: B1.AC1 13.25,91.23 X2.2
N$19
  Top 0.305: IC1.7 48.96,31.75 49.53,31.18 R16.2 R18.1
N$21
  Top 0.406: C10.2 35.31,13.4 R19.2
N$34
  Top 0.406: C1.2 16.51,82.22 D2.A
  Bottom 0.406: C1.2 17.14,88.46 17.65,87.95
  Bottom 3.81: B1.AC2 20.75,91.04 17.65,87.95 7.69,77.99 X2.1
N$64
  Top 0.305: R17.2 R20.1 51.31,18.86 50.86,19.3 50.86,20.45 49.21,22.1 IC2.7
N$77
  Top 0.254: C21.2 15.94,6.54 R25.2
N$79
  Top 0.305: R2.1 50.42,74.11 50.29,73.98 | Q1.B 50.29,73.98 | P1.1 53.91,70.61 P1.S | P1.A P1.S | P1.S 54.23,71.31 52.83,72.71 50.8,72.71 50.29,73.22 50.29,73.98
N$127
  Top 0.305: IC5.6 6.74,22.09 4.95,23.88 4.95,25.97 X3.2
N$128
  Top 0.254: IC3.6 20.69,9.83 19.81,8.96 R27.1 R22.2 19.68,4.64 C21.1 17.71,4.51 C22.1
N$131
  Top 0.356: C8.2 27.88,13.15 27.81,13.08 IC3.16
N$135  (1 unrouted)
  Top 0.254: IC3.5 20.56,10.46 18.48,8.38 15.24,8.38 13.97,7.11 13.97,6.67 14.03,6.67 | 13.97,4.32 C22.2 R25.1
N$165
  Top 0.254: IC3.7 20.79,9.17 20.57,8.95 20.57,8.13 20.83,7.87 22.99,7.87 23.43,7.43 23.43,4.83 23.75,4.51 R24.1
N$166  (1 unrouted)
  Top 0.356: IC3.1 21.67,13.26 21.65,13.27
  Top 0.406: 21.65,13.27 21.65,14.86 C15.2
N$167
  Top 0.254: IC3.8 23.24,8.51 24.57,7.18
  Top 0.305: 24.57,7.18 24.57,6.61 C18.2
N$168  (1 unrouted)
  Top 0.305: IC3.10 28.42,9.17 29.02,8.57 29.02,6.99 28.64,6.48
N$179  (2 unrouted)
  Top 0.61: D4.A.1 D4.A 38.54,28.96 38.54,27.37 L2.1 | C5.1 L2.1
N$180  (1 unrouted)
  Top 0.254: R14.2 14.48,15.62 14.41,15.56 | IC3.2 20.79,12.42 20.07,13.14 20.07,14.8 19.81,15.05 14.98,15.05 R13.1
N$187  (1 unrouted)
  Top 0.305: R1.2 49.15,69.92 52.77,66.29 52.77,55.24 50.48,52.96
N$188  (1 unrouted)
  Top 0.305: 53.53,14.8 49.53,14.8 48.96,14.22 IC6.7 | 53.53,14.8 X5.2 | R28.1 53.41,14.92 53.53,14.8
N$190
  Top 0.305: C26.2 48.96,4.63 IC6.2 48.96,9.46 50.23,10.73 | IC6.6 50.23,10.73 | 50.23,10.73 53.66,10.73 54.36,10.03 X5.1
N$193  (1 unrouted)
  Top 0.305: X3.1 2.35,22.04 2.54,21.84 2.48,21.84 2.41,21.78 | C24.1 4.1,21.8 4.19,21.72 IC5.8
N$198
  Top 0.305: X3.3 8.01,25.46 IC5.5 8,20.26 7.37,19.62 2.86,19.62 2.48,20 C24.2
N$202
  Top 0.406: R23.1 R26.2
  Top 0.61: R26.2 43.37,11.62 IC4.1
POUT  (via drill 0.6)  (1 unrouted)
  Top 0.254: 46.8,59.37 46.8,59.5 X1.16 | 48.01,60.71 50.29,60.77
  Top 0.305: Q1.E 48.15,76.37 48.13,76.39 | R2.2 50.42,76.39 48.13,76.39 | 48.13,76.39 45.09,76.39 v45.02,76.45
  Top 0.406: v45.02,76.45 R9.1
  Top 1.27: 50.48,63.18 48.01,60.71 | 50.29,60.77 47.82,58.29
  Top 2.184: X1.17 X1.15 X1.16 X1.14
  Top 3.048: C2.+3 28.13,46.48 24,50.61 24,50.67 23.56,51.12 23.56,59.88 28.19,64.52 28.19,66.17 28.19,69.79 C2.+2
  Top 3.81: 46.8,59.37 34.99,59.37 28.19,66.17 27.88,66.17 27.62,66.42 27.62,67.63 18.29,58.29 C2.+
  Bottom 0.406: v45.02,76.45 38.16,76.45 35.47,79.15
  Bottom 2.54: Q2.D 39,84.91 38.99,84.9 38.99,83.06 39.18,82.87 45.09,82.87 51,88.78 Q3.D
  Bottom 3.81: 39.18,82.87 35.47,79.15 28.13,71.82 C2.+2
PWRGOOD  (via drill 0.6)
  Top 0.254: 48.13,36.7 v49.28,36.7 | R15.1 48.13,36.7 | 48.13,36.7 48.13,34.35 47.57,34.35 IC1.5
  Bottom 0.254: X1.1 50.42,37.85 v49.28,36.7
Q4A
  pour Top (isolate 0.406): 27.62,89.53 27.62,78.74 39.05,78.74 39.05,89.53
Q5C
  Top 0.406: Q5.2 49.89,81.92 C3.1 46.23,81.92 45.15,83 ZD1.A 45.15,85.73 | R5.2 45.15,85.73 | R6.2 R4.2 45.15,85.73
  pour Top (isolate 0.406): 49.21,89.22 59.69,89.22 59.69,72.2 51.75,72.2 51.75,78.42 49.21,78.42
SW
  Top 0.254: IC3.14 30.05,11.76
  Top 0.356: IC3.15 29.17,12.42 29.21,12.38
  pour Top (isolate 0.305, no thermals): 24.96,23.69 36.96,23.69 36.96,16.64 34.1,16.64 34.1,14.35 32.96,14.35 32.96,11.75 28.77,11.75 28.7,11.81 26.8,11.81 26.8,12.45 28.7,12.45 29.21,12.95 29.21,17.08 28.89,17.4 24.96,17.4
SYNC
  Top 0.254: 21.67,11.11 IC3.4 20.46,11.12 18.35,9.02 6.03,9.02 4.89,10.16 4.89,11.24
  Top 0.305: X4.2 4.89,11.24 4.89,13.72 5.46,14.29 IC5.2
SYNC_ISOLATION
  cutout Bottom (isolate 0.305, rank 2): 0.32,28.57 8.83,28.57 8.83,18.92 0.32,18.92
TEMP_FREQ
  Top 0.254: 58.93,10.35 58.93,37.91 51.56,45.28 50.48,45.28 X1.3
  Top 0.305: IC6.3 50.23,9.4 50.86,10.03 52.51,10.03 54.17,8.38 56.96,8.38 58.93,10.35
V+  (1 unrouted)
  Top 0.305: IC1.1 51.31,30.48 51.05,30.23 51.05,28.89 R16.1 | 56.52,29.72 56.45,29.78
  Top 0.508: C7.1.1 56.52,29.72 C7.1
  Top 0.61: 56.52,29.72 55.88,29.72 54.93,30.67 54.93,36.39 | 54.93,36.39 54.93,37.78 52.39,40.32 47.05,40.32 46.1,41.27 46.1,46.1 X1.6 | IC1.1 54.86,30.48 54.93,30.54 | D6.C 54.99,36.32 54.93,36.39
V-  (via drill 0.7)  (1 unrouted)
  Top 0.305: C19.2 43.37,5.78
  Top 0.406: C20.2.1 C20.2
  Top 0.508: R26.1 43.37,5.78
  Top 0.61: C20.2.1 43.24,8.32 43.31,8.26 | C20.2 39.5,10.67 IC4.2 | v44.96,38.8 D7.A
  Bottom 0.61: IC4.2 42.48,11.49 44.96,13.97 v44.96,38.8 44.96,43.75 46.55,45.34 X1.4
VOUT+  (via drill 0.6)  (2 unrouted)
  Top 0.254: 21.71,4.38 21.71,3.11 22.54,2.29 29.21,2.29 29.97,3.05 29.97,9.08 v29.65,9.4
  Top 0.356: IC3.11 29.22,9.83 v29.65,9.4
  Top 0.61: 19.88,33.34 C12.1.1 21.02,34.54 35.88,34.54 38.86,31.56 L3.1.1
  Bottom 0.305: v29.65,9.4 29.65,12.95 23.56,19.05 v23.56,23.88
  pour Top (isolate 0.406, no thermals): 23.94,35.18 23.94,20.89 12.26,20.89 12.26,35.18
VOUT-
  Top 0.61: 27.81,31.75 D4.C.1 D4.C | 27.81,25.4 29.84,25.4 TR1.2
  pour Top (isolate 0.406, no thermals): 32.38,24.45 24.96,24.45 24.96,33.34 32.38,33.34

### Text on the board
Bottom: PSU mosfet pre-regulator (10/2015 r3B3b)
tPlace: AC in | PSU mosfet pre-regulator | (10/2015 r3B3b) | Power | Sync | out | Sync | in | Temp
tDocu: Licensed under the TAPR Open Hardware License (www.tapr.org/OHL)
_tNames: Q2 | Q3 | C1 | ZD2 | B1 | R4 | ZD1 | R5 | R3 | R6 | Q5 | R8 | D2 | C3 | Q4 | R10 | R9 | D1 | ZD2 | R7 | R11 | D3 | R2 | X2 | Q1 | R1 | P1 | C2 | X1 | R12 | C4 | D7 | R15 | D6 | L3 | C13 | C12 | IC1 | C7 | D4 | X3 | C16 | L2 | C5 | R16 | R18 | C14 | TR1 | C24 | C17 | C6 | IC2 | R14 | C25 | IC5 | C10 | R20 | R17 | LED | R13 | C9 | C15 | R28 | C8 | IC4 | C23 | X5 | R21 | R26 | L1 | R27 | IC3 | R19 | X4 | R25 | R23 | IC6 | C22 | C18 | D5 | C19 | C21 | R22 | R24 | C11 | C20 | C26